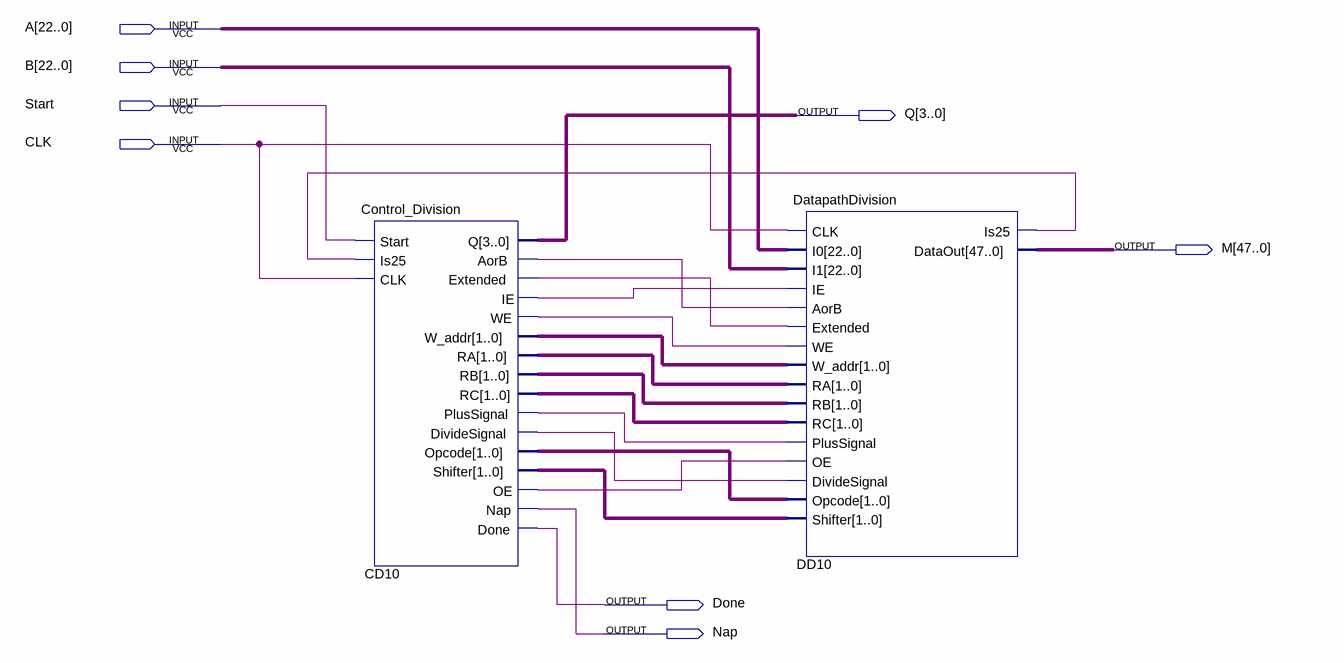
[diagram p0: schematic sheet]
// Quartus schematic Mantissa_Division.bdf as structural Verilog: 2 symbols, 8 pins
module Mantissa_Division (
  input  [22:0] A,
  input  [22:0] B,
  input  Start,
  input  CLK,
  output [3:0] Q,
  output [47:0] M,
  output Done,
  output Nap
);

  wire CD10_aorb, CD10_dividesignal, CD10_extended, CD10_ie, CD10_oe, CD10_plussignal, CD10_we, DD10_is25;
  wire [1:0] CD10_opcode, CD10_ra, CD10_rb, CD10_rc, CD10_shifter, CD10_w_addr;

  Control_Division CD10 (
    .Start(Start), .Is25(DD10_is25), .CLK(CLK), .Q(Q), .AorB(CD10_aorb), .Extended(CD10_extended),
    .IE(CD10_ie), .WE(CD10_we), .W_addr(CD10_w_addr), .RA(CD10_ra), .RB(CD10_rb), .RC(CD10_rc),
    .PlusSignal(CD10_plussignal), .DivideSignal(CD10_dividesignal), .Opcode(CD10_opcode),
    .Shifter(CD10_shifter), .OE(CD10_oe), .Nap(Nap), .Done(Done));
  DatapathDivision DD10 (
    .CLK(CLK), .I0(A), .I1(B), .IE(CD10_ie), .AorB(CD10_aorb), .Extended(CD10_extended), .WE(CD10_we),
    .W_addr(CD10_w_addr), .RA(CD10_ra), .RB(CD10_rb), .RC(CD10_rc), .PlusSignal(CD10_plussignal),
    .OE(CD10_oe), .DivideSignal(CD10_dividesignal), .Opcode(CD10_opcode), .Shifter(CD10_shifter),
    .Is25(DD10_is25), .DataOut(M));
endmodule
